# Altium schematic sheet etapa_1_2.SchDoc
size A4
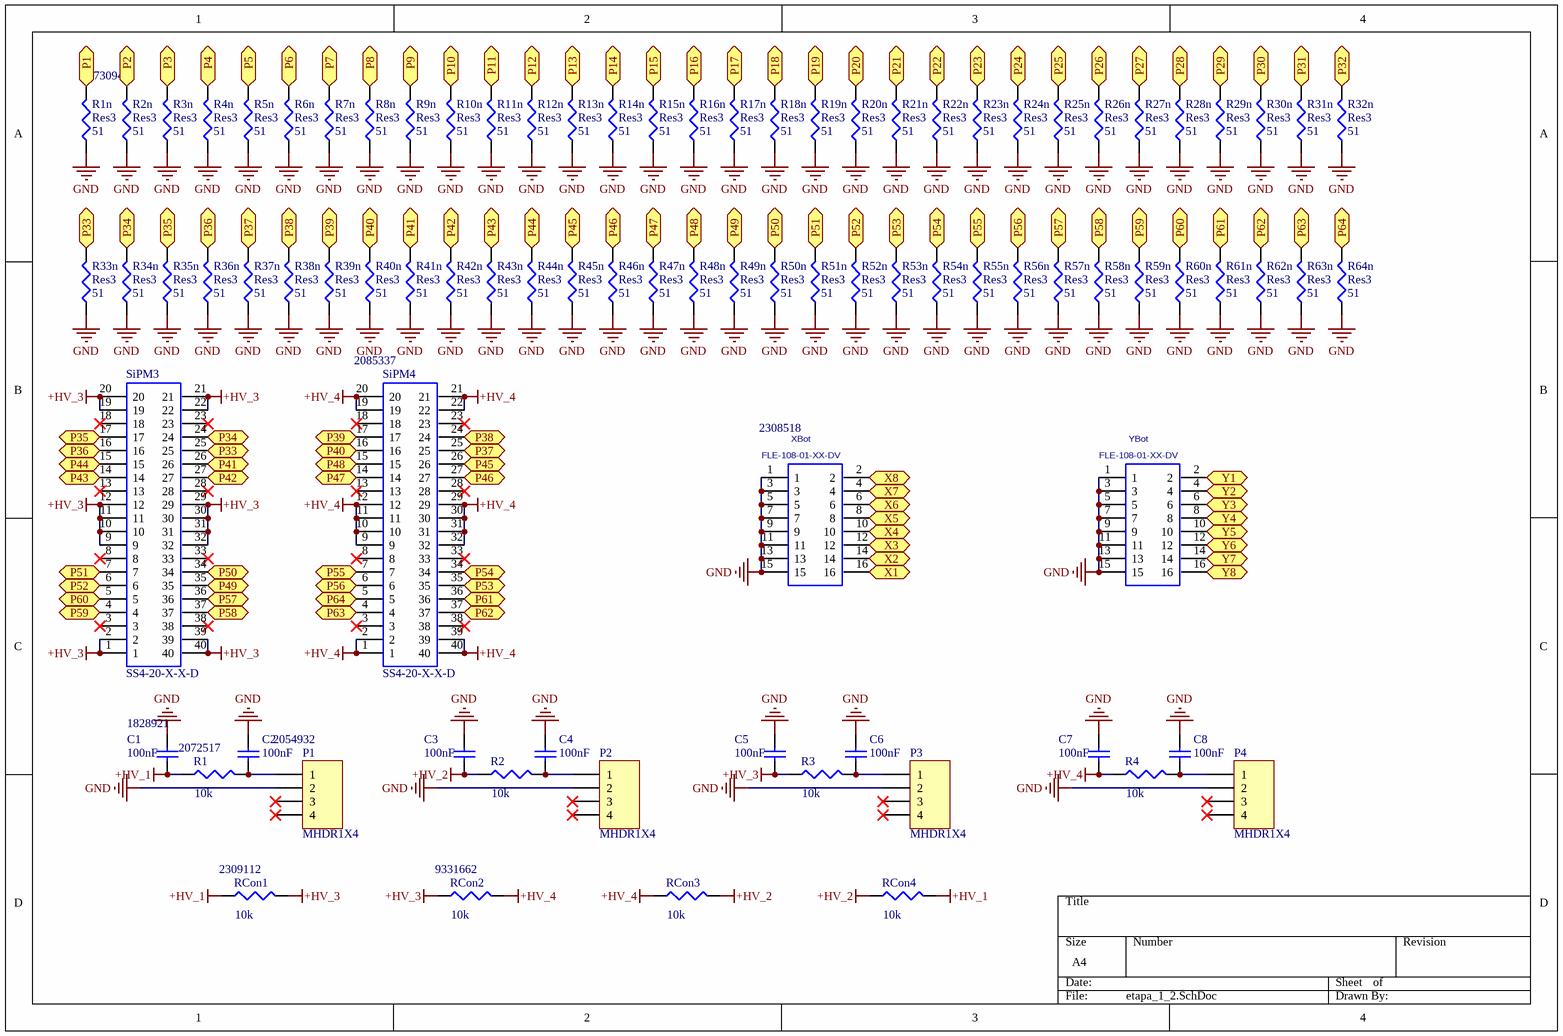
[diagram p0: etapa_1_2.SchDoc]

## Parts
C1  value 100nF  Supplier Part Number 1: 1828921  [1608[0603]]  (hidden comment: Cap Semi)
C2  value 100nF  [1608[0603]]  (hidden comment: Cap Semi)
C3  value 100nF  [1608[0603]]  (hidden comment: Cap Semi)
C4  value 100nF  [1608[0603]]  (hidden comment: Cap Semi)
C5  value 100nF  [1608[0603]]  (hidden comment: Cap Semi)
C6  value 100nF  [1608[0603]]  (hidden comment: Cap Semi)
C7  value 100nF  [1608[0603]]  (hidden comment: Cap Semi)
C8  value 100nF  [1608[0603]]  (hidden comment: Cap Semi)
P1  MHDR1X4  Supplier Part Number 1: 2054932  [MHDR1X4]
P2  MHDR1X4  [MHDR1X4]
P3  MHDR1X4  [MHDR1X4]
P4  MHDR1X4  [MHDR1X4]
R1  value 10k  Supplier Part Number 1: 2072517  [0402]  (hidden comment: Res3)
R1n  Res3  value 51  Supplier Part Number 1: 2073094  [0402]
R2  value 10k  [0402]  (hidden comment: Res3)
R2n  Res3  value 51  [0402]
R3  value 10k  [0402]  (hidden comment: Res3)
R3n  Res3  value 51  [0402]
R4  value 10k  [0402]  (hidden comment: Res3)
R4n  Res3  value 51  [0402]
R5n  Res3  value 51  [0402]
R6n  Res3  value 51  [0402]
R7n  Res3  value 51  [0402]
R8n  Res3  value 51  [0402]
R9n  Res3  value 51  [0402]
R10n  Res3  value 51  [0402]
R11n  Res3  value 51  [0402]
R12n  Res3  value 51  [0402]
R13n  Res3  value 51  [0402]
R14n  Res3  value 51  [0402]
R15n  Res3  value 51  [0402]
R16n  Res3  value 51  [0402]
R17n  Res3  value 51  [0402]
R18n  Res3  value 51  [0402]
R19n  Res3  value 51  [0402]
R20n  Res3  value 51  [0402]
R21n  Res3  value 51  [0402]
R22n  Res3  value 51  [0402]
R23n  Res3  value 51  [0402]
R24n  Res3  value 51  [0402]
R25n  Res3  value 51  [0402]
R26n  Res3  value 51  [0402]
R27n  Res3  value 51  [0402]
R28n  Res3  value 51  [0402]
R29n  Res3  value 51  [0402]
R30n  Res3  value 51  [0402]
R31n  Res3  value 51  [0402]
R32n  Res3  value 51  [0402]
R33n  Res3  value 51  [0402]
R34n  Res3  value 51  [0402]
R35n  Res3  value 51  [0402]
R36n  Res3  value 51  [0402]
R37n  Res3  value 51  [0402]
R38n  Res3  value 51  [0402]
R39n  Res3  value 51  [0402]
R40n  Res3  value 51  [0402]
R41n  Res3  value 51  [0402]
R42n  Res3  value 51  [0402]
R43n  Res3  value 51  [0402]
R44n  Res3  value 51  [0402]
R45n  Res3  value 51  [0402]
R46n  Res3  value 51  [0402]
R47n  Res3  value 51  [0402]
R48n  Res3  value 51  [0402]
R49n  Res3  value 51  [0402]
R50n  Res3  value 51  [0402]
R51n  Res3  value 51  [0402]
R52n  Res3  value 51  [0402]
R53n  Res3  value 51  [0402]
R54n  Res3  value 51  [0402]
R55n  Res3  value 51  [0402]
R56n  Res3  value 51  [0402]
R57n  Res3  value 51  [0402]
R58n  Res3  value 51  [0402]
R59n  Res3  value 51  [0402]
R60n  Res3  value 51  [0402]
R61n  Res3  value 51  [0402]
R62n  Res3  value 51  [0402]
R63n  Res3  value 51  [0402]
R64n  Res3  value 51  [0402]
RCon1  value 10k  Supplier Part Number 1: 2309112  [6-0805_M]  (hidden comment: Res3)
RCon2  value 10k  Supplier Part Number 1: 9331662  [1608[0603]]  (hidden comment: Res3)
RCon3  value 10k  [6-0805_M]  (hidden comment: Res3)
RCon4  value 10k  [1608[0603]]  (hidden comment: Res3)
SiPM3  SS4-20-X-X-D  [SS4-20-X-X-D]
SiPM4  SS4-20-X-X-D  Supplier Part Number 1: 2085337  [SS4-20-X-X-D]
XBot  FLE-108-01-XX-DV  Supplier Part Number 1: 2308518  [FLE-108-01-XX-DV]
YBot  FLE-108-01-XX-DV  [FLE-108-01-XX-DV]

## Ports
P1 (out), P2 (out), P3 (out), P4 (out), P5 (out), P6 (out), P7 (out), P8 (out), P9 (out), P10 (out), P11 (out), P12 (out), P13 (out), P14 (out), P15 (out), P16 (out), P17 (out), P18 (out), P19 (out), P20 (out), P21 (out), P22 (out), P23 (out), P24 (out), P25 (out), P26 (out), P27 (out), P28 (out), P29 (out), P30 (out), P31 (out), P32 (out), P33 (in), P33 (out), P34 (in), P34 (out), P35 (in), P35 (out), P36 (in), P36 (out), P37 (in), P37 (out), P38 (in), P38 (out), P39 (in), P39 (out), P40 (in), P40 (out), P41 (in), P41 (out), P42 (in), P42 (out), P43 (in), P43 (out), P44 (in), P44 (out), P45 (in), P45 (out), P46 (in), P46 (out), P47 (in), P47 (out), P48 (in), P48 (out), P49 (in), P49 (out), P50 (in), P50 (out), P51 (in), P51 (out), P52 (in), P52 (out), P53 (in), P53 (out), P54 (in), P54 (out), P55 (in), P55 (out), P56 (in), P56 (out), P57 (in), P57 (out), P58 (in), P58 (out), P59 (in), P59 (out), P60 (in), P60 (out), P61 (in), P61 (out), P62 (in), P62 (out), P63 (in), P63 (out), P64 (in), P64 (out), X1 (out), X2 (out), X3 (out), X4 (out), X5 (out), X6 (out), X7 (out), X8 (out), Y1 (out), Y2 (out), Y3 (out), Y4 (out), Y5 (out), Y6 (out), Y7 (out), Y8 (out)

## Nets
+HV_1: C1.2 R1.1 RCon1.1 RCon4.2
+HV_2: C3.2 R2.1 RCon3.2 RCon4.1
+HV_3: C5.2 R3.1 RCon1.2 RCon2.1 SiPM3.1 SiPM3.2 SiPM3.9 SiPM3.10 SiPM3.11 SiPM3.12 SiPM3.19 SiPM3.20 SiPM3.21 SiPM3.22 SiPM3.29 SiPM3.30 SiPM3.31 SiPM3.32 SiPM3.39 SiPM3.40
+HV_4: C7.2 R4.1 RCon2.2 RCon3.1 SiPM4.1 SiPM4.2 SiPM4.9 SiPM4.10 SiPM4.11 SiPM4.12 SiPM4.19 SiPM4.20 SiPM4.21 SiPM4.22 SiPM4.29 SiPM4.30 SiPM4.31 SiPM4.32 SiPM4.39 SiPM4.40
GND: C1.1 C2.2 C3.1 C4.2 C5.1 C6.2 C7.1 C8.2 P1.2 P2.2 P3.2 P4.2 R1n.1 R2n.1 R3n.1 R4n.1 R5n.1 R6n.1 R7n.1 R8n.1 R9n.1 R10n.1 R11n.1 R12n.1 R13n.1 R14n.1 R15n.1 R16n.1 R17n.1 R18n.1 R19n.1 R20n.1 R21n.1 R22n.1 R23n.1 R24n.1 R25n.1 R26n.1 R27n.1 R28n.1 R29n.1 R30n.1 R31n.1 R32n.1 R33n.1 R34n.1 R35n.1 R36n.1 R37n.1 R38n.1 R39n.1 R40n.1 R41n.1 R42n.1 R43n.1 R44n.1 R45n.1 R46n.1 R47n.1 R48n.1 R49n.1 R50n.1 R51n.1 R52n.1 R53n.1 R54n.1 R55n.1 R56n.1 R57n.1 R58n.1 R59n.1 R60n.1 R61n.1 R62n.1 R63n.1 R64n.1 XBot.1 XBot.3 XBot.5 XBot.7 XBot.9 XBot.11 XBot.13 XBot.15 YBot.1 YBot.3 YBot.5 YBot.7 YBot.9 YBot.11 YBot.13 YBot.15
P1: R1n.2 ; port P1
P2: R2n.2 ; port P2
P3: R3n.2 ; port P3
P4: R4n.2 ; port P4
P5: R5n.2 ; port P5
P6: R6n.2 ; port P6
P7: R7n.2 ; port P7
P8: R8n.2 ; port P8
P9: R9n.2 ; port P9
P10: R10n.2 ; port P10
P11: R11n.2 ; port P11
P12: R12n.2 ; port P12
P13: R13n.2 ; port P13
P14: R14n.2 ; port P14
P15: R15n.2 ; port P15
P16: R16n.2 ; port P16
P17: R17n.2 ; port P17
P18: R18n.2 ; port P18
P19: R19n.2 ; port P19
P20: R20n.2 ; port P20
P21: R21n.2 ; port P21
P22: R22n.2 ; port P22
P23: R23n.2 ; port P23
P24: R24n.2 ; port P24
P25: R25n.2 ; port P25
P26: R26n.2 ; port P26
P27: R27n.2 ; port P27
P28: R28n.2 ; port P28
P29: R29n.2 ; port P29
P30: R30n.2 ; port P30
P31: R31n.2 ; port P31
P32: R32n.2 ; port P32
P33: R33n.2 SiPM3.25 ; port P33
P34: R34n.2 SiPM3.24 ; port P34
P35: R35n.2 SiPM3.17 ; port P35
P36: R36n.2 SiPM3.16 ; port P36
P37: R37n.2 SiPM4.25 ; port P37
P38: R38n.2 SiPM4.24 ; port P38
P39: R39n.2 SiPM4.17 ; port P39
P40: R40n.2 SiPM4.16 ; port P40
P41: R41n.2 SiPM3.26 ; port P41
P42: R42n.2 SiPM3.27 ; port P42
P43: R43n.2 SiPM3.14 ; port P43
P44: R44n.2 SiPM3.15 ; port P44
P45: R45n.2 SiPM4.26 ; port P45
P46: R46n.2 SiPM4.27 ; port P46
P47: R47n.2 SiPM4.14 ; port P47
P48: R48n.2 SiPM4.15 ; port P48
P49: R49n.2 SiPM3.35 ; port P49
P50: R50n.2 SiPM3.34 ; port P50
P51: R51n.2 SiPM3.7 ; port P51
P52: R52n.2 SiPM3.6 ; port P52
P53: R53n.2 SiPM4.35 ; port P53
P54: R54n.2 SiPM4.34 ; port P54
P55: R55n.2 SiPM4.7 ; port P55
P56: R56n.2 SiPM4.6 ; port P56
P57: R57n.2 SiPM3.36 ; port P57
P58: R58n.2 SiPM3.37 ; port P58
P59: R59n.2 SiPM3.4 ; port P59
P60: R60n.2 SiPM3.5 ; port P60
P61: R61n.2 SiPM4.36 ; port P61
P62: R62n.2 SiPM4.37 ; port P62
P63: R63n.2 SiPM4.4 ; port P63
P64: R64n.2 SiPM4.5 ; port P64
X1: XBot.16 ; port X1
X2: XBot.14 ; port X2
X3: XBot.12 ; port X3
X4: XBot.10 ; port X4
X5: XBot.8 ; port X5
X6: XBot.6 ; port X6
X7: XBot.4 ; port X7
X8: XBot.2 ; port X8
Y1: YBot.2 ; port Y1
Y2: YBot.4 ; port Y2
Y3: YBot.6 ; port Y3
Y4: YBot.8 ; port Y4
Y5: YBot.10 ; port Y5
Y6: YBot.12 ; port Y6
Y7: YBot.14 ; port Y7
Y8: YBot.16 ; port Y8
NetC2_1: C2.1 P1.1 R1.2
NetC4_1: C4.1 P2.1 R2.2
NetC6_1: C6.1 P3.1 R3.2
NetC8_1: C8.1 P4.1 R4.2

Not connected (* = marked no-connect by the designer): P1 3* 4*; P2 3* 4*; P3 3* 4*; P4 3* 4*; SiPM3 3* 8* 13* 18* 23* 28* 33* 38*; SiPM4 3* 8* 13* 18* 23* 28* 33* 38*

## Library data of the parts
C1-C8 = Cap Semi: Capacitor (Semiconductor SIM Model); Published: 8-Jun-2000; LatestRevisionDate: 29-May-2009; LatestRevisionNote: IPC-7351 Footprint Added.; PackageReference: C1206; Publisher: Altium Limited; PackageDescription: Chip Capacitor
  C1: Supplier 1: Farnell
P1-P4 = MHDR1X4: Header, 4-Pin; LatestRevisionDate: 17-Jul-2002; LatestRevisionNote: Re-released for DXP Platform.; Publisher: Altium Limited
  P1: Supplier 1: Farnell
R1 R1n R2 R2n R3 R3n R4 R4n R5n R6n R7n R8n R9n R10n R11n R12n R13n R14n R15n R16n R17n R18n R19n R20n R21n R22n R23n R24n R25n R26n R27n R28n R29n R30n R31n R32n R33n R34n R35n R36n R37n R38n R39n R40n R41n R42n R43n R44n R45n R46n R47n R48n R49n R50n R51n R52n R53n R54n R55n R56n R57n R58n R59n R60n R61n R62n R63n R64n RCon1-RCon4 = Res3: Resistor; Published: 8-Jun-2000; LatestRevisionDate: 29-May-2009; LatestRevisionNote: IPC-7351 Footprint Added.; PackageReference: J1-0603; Publisher: Altium Limited; PackageDescription: Chip Resistor
  R1 R1n RCon1 RCon2: Supplier 1: Farnell
XBot YBot = FLE-108-01-XX-DV: DUAL ROW 0.050'' STRIP ASSEMBLY.; MANUFACTURER: SAMTEC; CREATED: December 2, 2014 - Wendy Xin; PCB DECAL: FLE-108-01-XX-DV
  XBot: Supplier 1: Farnell
SiPM3 SiPM4 = SS4-20-X-X-D
  SiPM4: Supplier 1: Farnell